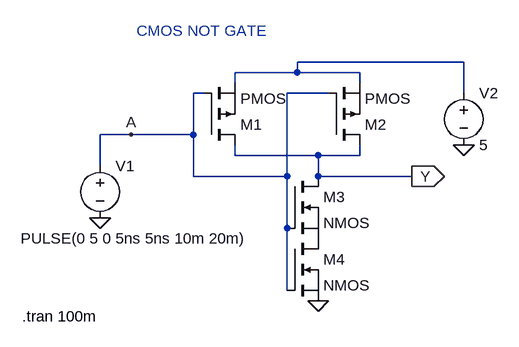
[diagram p0: schematic CMOS_NOT.asc]
CMOS_NOT.asc, the LTspice schematic file:
Version 4.1
SHEET 1 880 680
WIRE 480 0 224 0
WIRE 224 16 224 0
WIRE 224 16 128 16
WIRE 320 16 224 16
WIRE 128 32 128 16
WIRE 320 32 320 16
WIRE 80 48 64 48
WIRE 272 48 208 48
WIRE 480 48 480 0
WIRE -32 112 -80 112
WIRE 64 112 64 48
WIRE 64 112 -32 112
WIRE 128 144 128 128
WIRE 256 144 128 144
WIRE 320 144 320 128
WIRE 320 144 256 144
WIRE -80 160 -80 112
WIRE 64 176 64 112
WIRE 208 176 208 48
WIRE 208 176 64 176
WIRE 256 176 256 144
WIRE 400 176 256 176
WIRE 208 256 208 176
WIRE 208 352 208 256
FLAG 480 128 0
FLAG -80 240 0
FLAG 256 368 0
FLAG 400 176 Y
IOPIN 400 176 Out
FLAG -32 112 A
SYMBOL pmos 80 128 M180
SYMATTR InstName M1
SYMBOL pmos 272 128 M180
SYMATTR InstName M2
SYMBOL nmos 208 176 R0
SYMATTR InstName M3
SYMBOL nmos 208 272 R0
SYMATTR InstName M4
SYMBOL voltage -80 144 R0
WINDOW 3 -122 128 Left 2
WINDOW 123 0 0 Left 0
WINDOW 39 0 0 Left 0
SYMATTR Value PULSE(0 5 0 5ns 5ns 10m 20m)
SYMATTR InstName V1
SYMBOL voltage 480 32 R0
WINDOW 123 0 0 Left 0
WINDOW 39 0 0 Left 0
SYMATTR InstName V2
SYMATTR Value 5
TEXT -24 -48 Left 2 ;CMOS NOT GATE
TEXT -200 392 Left 2 !.tran 100m

The netlist it stands for:
* CMOS_NOT.asc
M1 Y A N001 N001 PMOS
M2 Y A N001 N001 PMOS
M3 Y A P001 P001 NMOS
M4 P001 A 0 0 NMOS
V1 A 0 PULSE(0 5 0 5ns 5ns 10m 20m)
V2 N001 0 5
.model NMOS NMOS
.model PMOS PMOS
.lib standard.mos
* CMOS NOT GATE
.tran 100m
.backanno
.end